# Altium schematic sheet minireg-tps560430.SchDoc
size A4; SheetNumber: 1; SheetTotal: 1
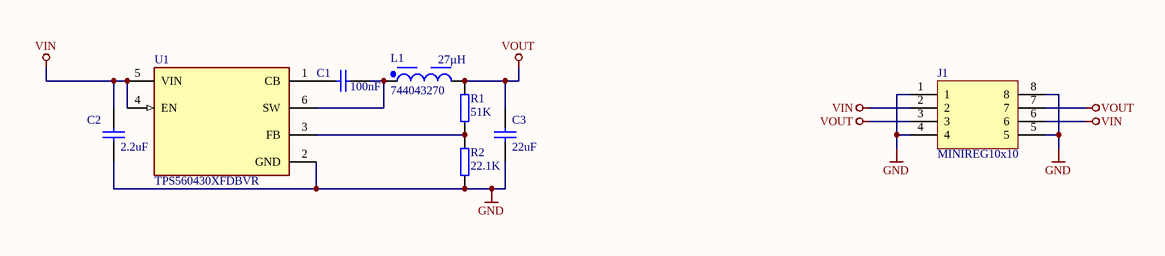
[diagram p0: minireg-tps560430.SchDoc]

## Parts
C1  value 100nF  [CAP0603]  (hidden comment: CAP)
C2  value 2.2uF  [CAP0603]  (hidden comment: CAP)
C3  value 22uF  [CAP0805]  (hidden comment: CAP)
J1  MINIREG10x10  [MINIREG8_10x10R]
L1  744043270  Inductance: 27µH  [WE-TPC_4828]
R1  value 51K  [RES0603]  (hidden comment: RES)
R2  value 22.1K  [RES0603]  (hidden comment: RES)
U1  TPS560430XFDBVR  [FP-DBV0006A-IPC_C]

## Nets
GND: C2.1 C3.1 J1.1 J1.4 J1.5 J1.8 R2.1 U1.2(GND)
VIN: C2.2 J1.2 J1.6 U1.4(EN) U1.5(VIN)
VOUT: C3.2 J1.3 J1.7 L1.2 R1.2
NetC1_1: C1.1 U1.1(CB)
NetC1_2: C1.2 L1.1 U1.6(SW)
NetR1_1: R1.1 R2.2 U1.3(FB)

## Library data of the parts
C1 = CAP-SM-0603-X7R-100nF: CAP SM 0603 X7R 100nF; Manufacturer: GENERIC; Part Number: CAP-SM-0603-X7R-100nF; Package: 0603
C2 = CAP-SM-0603-X5R-2.2uF: CAP SM 0603 X5R 2.2uF; Manufacturer: GENERIC; Part Number: CAP-SM-0603-X5R-2.2uF; Package: 0603
C3 = CAP-SM-0805-X5R-22uF: CAP SM 0805 X5R 22uF; Manufacturer: GENERIC; Part Number: CAP-SM-0805-X5R-22uF; Package: 0805
L1 = 744043270: NexarPartId: 39208936; DC Resistance (DCR): 170mΩ; Current Rating: 890mA; Min Operating Temperature: -40°C; RoHS: Compliant; Length: 4.8mm; Number of Pins: 2; Width: 4.8mm; Height: 2.8mm; Max Operating Temperature: 125°C; Ambient Temperature Range Low: -40°C; Ambient Temperature Range High: 95°C
R1 = RES-SM-0603-51K: RES SM 0603 51K; Manufacturer: GENERIC; Part Number: RES-SM-0603-51K; Package: 0603
R2 = RES-SM-0603-22.1K: RES SM 0603 22.1K; Manufacturer: GENERIC; Part Number: RES-SM-0603-22.1K; Package: 0603
U1 = TPS560430XFDBVR: IC REG BUCK PWM 600MA SOT23-6; Max Output Voltage: 34.2V; Switching Frequency: 1.1MHz; Synchronous Rectifier: Yes; Min Output Voltage: 1V; Number of Outputs: 1; Max Input Voltage: 36V; Output Configuration: Positive; Min Input Voltage: 4V; RoHS Compliant: Yes; Output Current: 600mA; Max Operating Temperature: 125°C; Output Type: PWM; Mount: Surface Mount; Min Operating Temperature: -40°C; Packaging: Tape and Reel; Case/Package: SOT-23-6; Features: UVLO